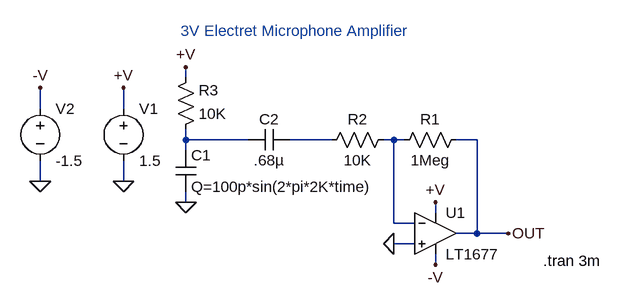
[diagram p0: schematic 1677.asc]
1677.asc, the LTspice schematic file:
Version 4
SHEET 1 896 680
WIRE -160 0 -160 -16
WIRE -384 48 -384 16
WIRE -256 48 -256 16
WIRE -160 96 -160 80
WIRE -64 96 -160 96
WIRE 64 96 0 96
WIRE 160 96 144 96
WIRE 176 96 160 96
WIRE 288 96 256 96
WIRE -160 112 -160 96
WIRE -384 160 -384 128
WIRE -256 160 -256 128
WIRE -160 192 -160 176
WIRE 224 208 224 192
WIRE 160 224 160 96
WIRE 192 224 160 224
WIRE 288 240 288 96
WIRE 288 240 256 240
WIRE 336 240 288 240
WIRE 192 256 160 256
WIRE 224 288 224 272
FLAG -256 160 0
FLAG 224 192 +V
FLAG -256 16 +V
FLAG 224 288 -V
FLAG -384 160 0
FLAG -384 16 -V
FLAG 160 256 0
FLAG -160 192 0
FLAG -160 -16 +V
FLAG 336 240 OUT
SYMBOL voltage -256 32 R0
SYMATTR InstName V1
SYMATTR Value 1.5
SYMBOL voltage -384 32 R0
SYMATTR InstName V2
SYMATTR Value -1.5
SYMBOL res 272 80 R90
WINDOW 0 0 56 VBottom 0
WINDOW 3 32 56 VTop 0
SYMATTR InstName R1
SYMATTR Value 1Meg
SYMBOL res 160 80 R90
WINDOW 0 0 56 VBottom 0
WINDOW 3 32 56 VTop 0
SYMATTR InstName R2
SYMATTR Value 10K
SYMBOL opamps\\LT1677 224 176 R0
SYMATTR InstName U1
SYMBOL cap -176 112 R0
SYMATTR InstName C1
SYMATTR Value Q=100p*sin(2*pi*2K*time)
SYMBOL res -176 96 M180
WINDOW 0 36 76 Left 0
WINDOW 3 36 40 Left 0
SYMATTR InstName R3
SYMATTR Value 10K
SYMBOL cap 0 80 R90
WINDOW 0 0 32 VBottom 0
WINDOW 3 32 32 VTop 0
SYMATTR InstName C2
SYMATTR Value .68µ
TEXT 390 282 Left 0 !.tran 3m
TEXT 8 -56 Bottom 0 ;3V Electret Microphone Amplifier

The netlist it stands for:
* 1677.asc
V1 +V 0 1.5
V2 -V 0 -1.5
R1 OUT N003 1Meg
R2 N003 N002 10K
XU1 0 N003 +V -V OUT LT1677  ; pins In+ In- V+ V- OUT
C1 N001 0 Q=100p*sin(2*pi*2K*time)
R3 N001 +V 10K
C2 N002 N001 .68µ
.tran 3m
* 3V Electret Microphone Amplifier
.lib LTC.lib
.backanno
.end